# Altium project CarrierMotherboard.PrjPcb (part 3 of 3)

## Sheet PCIE.SchDoc
size A3; SheetNumber: 9; SheetTotal: 9
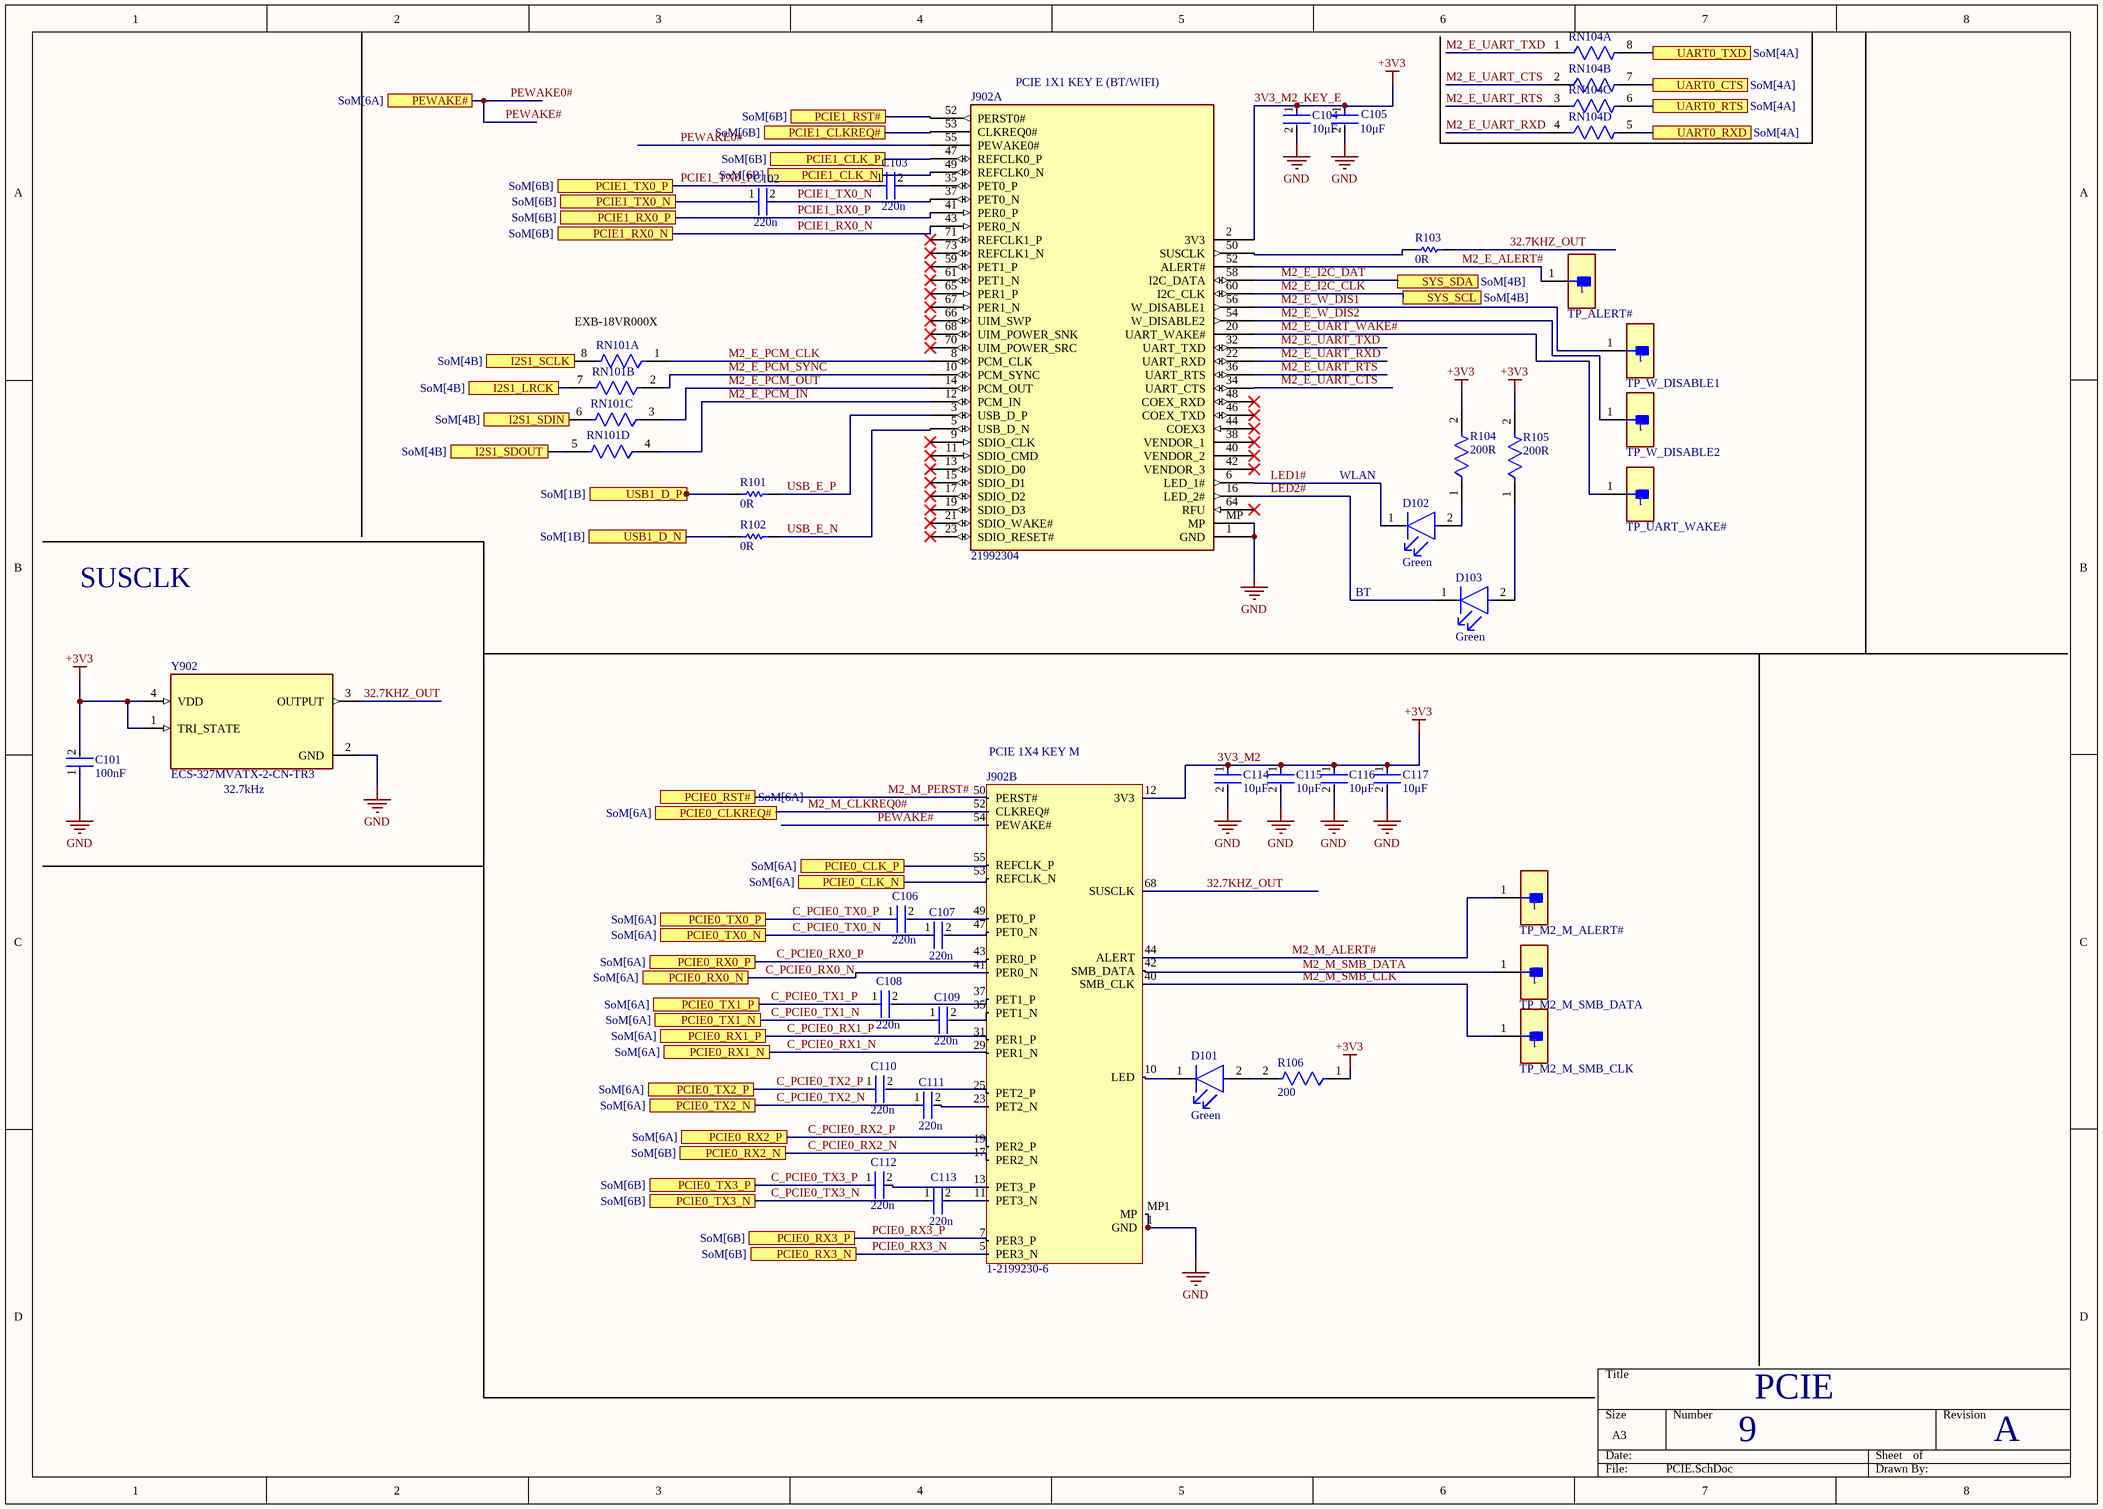
[diagram p9: PCIE.SchDoc]

### Parts
C101  100nF  [FP-GRM155-0_05-IPC_B]
C102  220n  [FP-C1005-050-0_05-IPC_B]
C103  220n  [FP-C1005-050-0_05-IPC_B]
C104  10μF  [FP-GRM31C-0_2-e0_3_0_8-MFG]
C105  10μF  [FP-GRM31C-0_2-e0_3_0_8-MFG]
C106  220n  [FP-C1005-050-0_05-IPC_B]
C107  220n  [FP-C1005-050-0_05-IPC_B]
C108  220n  [FP-C1005-050-0_05-IPC_B]
C109  220n  [FP-C1005-050-0_05-IPC_B]
C110  220n  [FP-C1005-050-0_05-IPC_B]
C111  220n  [FP-C1005-050-0_05-IPC_B]
C112  220n  [FP-C1005-050-0_05-IPC_B]
C113  220n  [FP-C1005-050-0_05-IPC_B]
C114  10μF  [FP-GRM31C-0_2-e0_3_0_8-MFG]
C115  10μF  [FP-GRM31C-0_2-e0_3_0_8-MFG]
C116  10μF  [FP-GRM31C-0_2-e0_3_0_8-MFG]
C117  10μF  [FP-GRM31C-0_2-e0_3_0_8-MFG]
D101  Green  [FP-LTST-C190GKT-MFG]
D102  Green  [FP-LTST-C190GKT-MFG]
D103  Green  [FP-LTST-C190GKT-MFG]
J902  1-2199230-6  [FP-1-2199230-6-MFG]  (part B of 2)
J902A  21992304  [TE_21992304]
R101  0R  [RESC1005X40X25LL05T05]
R102  0R  [RESC1005X40X25LL05T05]
R103  0R  [RESC1005X40X25LL05T05]
R104  200R  [FP-CR0402-IPC_C]
R105  200R  [FP-CR0402-IPC_C]
R106  200  [FP-CR0402-IPC_C]
RN101  (no value)  [FP-EXB-18V-MFG]  (parts A,B,C,D of 4)
RN104  EXB-18VR000X  [FP-EXB-18V-MFG]  (value not drawn)  (parts A,B,C,D of 4)
TP1  TP_ALERT#  [FP-S2751-46R-MFG]
TP2  TP_W_DISABLE1  [FP-S2751-46R-MFG]
TP3  TP_W_DISABLE2  [FP-S2751-46R-MFG]
TP4  TP_UART_WAKE#  [FP-S2751-46R-MFG]
TP5  TP_M2_M_ALERT#  [FP-S2751-46R-MFG]
TP6  TP_M2_M_SMB_DATA  [FP-S2751-46R-MFG]
TP7  TP_M2_M_SMB_CLK  [FP-S2751-46R-MFG]
Y902  ECS-327MVATX-2-CN-TR3  [OSC_ECS-2520S25-250-FN-TR]

### Ports
I2S1_LRCK (see SoM[4B]), I2S1_SCLK (see SoM[4B]), I2S1_SDIN (see SoM[4B]), I2S1_SDOUT (see SoM[4B]), PCIE0_CLK_N (see SoM[6A]), PCIE0_CLK_P (see SoM[6A]), PCIE0_CLKREQ# (see SoM[6A]), PCIE0_RST# (see SoM[6A]), PCIE0_RX0_N (see SoM[6A]), PCIE0_RX0_P (see SoM[6A]), PCIE0_RX1_N (see SoM[6A]), PCIE0_RX1_P (see SoM[6A]), PCIE0_RX2_N (see SoM[6B]), PCIE0_RX2_P (see SoM[6A]), PCIE0_RX3_N (see SoM[6B]), PCIE0_RX3_P (see SoM[6B]), PCIE0_TX0_N (see SoM[6A]), PCIE0_TX0_P (see SoM[6A]), PCIE0_TX1_N (see SoM[6A]), PCIE0_TX1_P (see SoM[6A]), PCIE0_TX2_N (see SoM[6A]), PCIE0_TX2_P (see SoM[6A]), PCIE0_TX3_N (see SoM[6B]), PCIE0_TX3_P (see SoM[6B]), PCIE1_CLK_N (see SoM[6B]), PCIE1_CLK_P (see SoM[6B]), PCIE1_CLKREQ# (see SoM[6B]), PCIE1_RST# (see SoM[6B]), PCIE1_RX0_N (see SoM[6B]), PCIE1_RX0_P (see SoM[6B]), PCIE1_TX0_N (see SoM[6B]), PCIE1_TX0_P (see SoM[6B]), PEWAKE# (see SoM[6A]), SYS_SCL (see SoM[4B]), SYS_SDA (see SoM[4B]), UART0_CTS (see SoM[4A]), UART0_RTS (see SoM[4A]), UART0_RXD (see SoM[4A]), UART0_TXD (see SoM[4A]), USB1_D_N (see SoM[1B]), USB1_D_P (see SoM[1B])

### Nets
3V3_M2: C101.2 C104.1 C105.1 C114.1 C115.1 C116.1 C117.1 J902.12(3V3) J902A.2(3V3) R104.2 R105.2 R106.1 Y902.1(TRI_STATE) Y902.4(VDD)  [also labelled +3V3, 3V3_M2_KEY_E]
GND: C101.1 C104.2 C105.2 C114.2 C115.2 C116.2 C117.2 J902.1(GND) J902.MP1(MP) J902A.1(GND) J902A.MP Y902.2(GND)  [project net 3V3_VDRV]
32.7KHZ_OUT: J902.68(SUSCLK) R103.2 Y902.3(OUTPUT)
C_PCIE0_RX0_N: J902.41(PER0_N) ; port PCIE0_RX0_N
C_PCIE0_RX0_P: J902.43(PER0_P) ; port PCIE0_RX0_P
C_PCIE0_RX1_N: J902.29(PER1_N) ; port PCIE0_RX1_N
C_PCIE0_RX1_P: J902.31(PER1_P) ; port PCIE0_RX1_P
C_PCIE0_RX2_N: J902.17(PER2_N) ; port PCIE0_RX2_N
C_PCIE0_RX2_P: J902.19(PER2_P) ; port PCIE0_RX2_P
C_PCIE0_TX0_N: C107.1 ; port PCIE0_TX0_N
C_PCIE0_TX0_P: C106.1 ; port PCIE0_TX0_P
C_PCIE0_TX1_N: C109.1 ; port PCIE0_TX1_N
C_PCIE0_TX1_P: C108.1 ; port PCIE0_TX1_P
C_PCIE0_TX2_N: C111.1 ; port PCIE0_TX2_N
C_PCIE0_TX2_P: C110.1 ; port PCIE0_TX2_P
C_PCIE0_TX3_N: C113.1 ; port PCIE0_TX3_N
C_PCIE0_TX3_P: C112.1 ; port PCIE0_TX3_P
LED1#: D102.1(C) J902A.6(LED_1#)
LED2#: D103.1(C) J902A.16(LED_2#)
M2_E_ALERT#: J902A.52(ALERT#) TP1.1
M2_E_I2C_CLK: J902A.60(I2C_CLK) ; port SYS_SCL
M2_E_I2C_DAT: J902A.58(I2C_DATA) ; port SYS_SDA
M2_E_PCM_CLK: J902A.8(PCM_CLK) RN101.1
M2_E_PCM_IN: J902A.12(PCM_IN) RN101.4
M2_E_PCM_OUT: J902A.14(PCM_OUT) RN101.3
M2_E_PCM_SYNC: J902A.10(PCM_SYNC) RN101.2
M2_E_UART_CTS: J902A.34(UART_CTS) RN104.2
M2_E_UART_RTS: J902A.36(UART_RTS) RN104.3
M2_E_UART_RXD: J902A.22(UART_RXD) RN104.4
M2_E_UART_TXD: J902A.32(UART_TXD) RN104.1
M2_E_UART_WAKE#: J902A.20(UART_WAKE#) TP4.1
M2_E_W_DIS1: J902A.56(W_DISABLE1) TP2.1
M2_E_W_DIS2: J902A.54(W_DISABLE2) TP3.1
M2_M_ALERT#: J902.44(ALERT) TP5.1
M2_M_CLKREQ0#: J902.52(CLKREQ#) ; port PCIE0_CLKREQ#
M2_M_PERST#: J902.50(PERST#) ; port PCIE0_RST#
M2_M_SMB_CLK: J902.40(SMB_CLK) TP7.1
M2_M_SMB_DATA: J902.42(SMB_DATA) TP6.1
PCIE0_RX3_N: J902.5(PER3_N) ; port PCIE0_RX3_N
PCIE0_RX3_P: J902.7(PER3_P) ; port PCIE0_RX3_P
PCIE1_RX0_N: J902A.43(PER0_N) ; port PCIE1_RX0_N
PCIE1_RX0_P: J902A.41(PER0_P) ; port PCIE1_RX0_P
PCIE1_TX0_N: C102.2 J902A.37(PET0_N)
PCIE1_TX0_P: C103.1 ; port PCIE1_TX0_P
PEWAKE#: J902.54(PEWAKE#) J902A.55(PEWAKE0#) ; port PEWAKE#  [also labelled PEWAKE0#]
USB_E_N: J902A.5(USB_D_N) R102.2
USB_E_P: J902A.3(USB_D_P) R101.2
NetC102_1: C102.1 ; port PCIE1_TX0_N
NetC103_2: C103.2 J902A.35(PET0_P)
NetC106_2: C106.2 J902.49(PET0_P)
NetC107_2: C107.2 J902.47(PET0_N)
NetC108_2: C108.2 J902.37(PET1_P)
NetC109_2: C109.2 J902.35(PET1_N)
NetC110_2: C110.2 J902.25(PET2_P)
NetC111_2: C111.2 J902.23(PET2_N)
NetC112_2: C112.2 J902.13(PET3_P)
NetC113_2: C113.2 J902.11(PET3_N)
NetD101_1: D101.1(C) J902.10(LED)
NetD101_2: D101.2(A) R106.2
NetD102_2: D102.2(A) R104.1
NetD103_2: D103.2(A) R105.1
NetJ15A_99: RN104.8 ; port UART0_TXD
NetJ15A_101: RN104.5 ; port UART0_RXD
NetJ15A_103: RN104.6 ; port UART0_RTS
NetJ15A_105: RN104.7 ; port UART0_CTS
NetJ15A_115: R102.1 ; port USB1_D_N
NetJ15A_117: R101.1 ; port USB1_D_P
NetJ15A_160: J902.53(REFCLK_N) ; port PCIE0_CLK_N
NetJ15A_162: J902.55(REFCLK_P) ; port PCIE0_CLK_P
NetJ15A_173: J902A.49(REFCLK0_N) ; port PCIE1_CLK_N
NetJ15A_175: J902A.47(REFCLK0_P) ; port PCIE1_CLK_P
NetJ15A_182: J902A.53(CLKREQ0#) ; port PCIE1_CLKREQ#
NetJ15A_183: J902A.52(PERST0#) ; port PCIE1_RST#
NetJ15A_220: RN101.5 ; port I2S1_SDOUT
NetJ15A_222: RN101.6 ; port I2S1_SDIN
NetJ15A_224: RN101.7 ; port I2S1_LRCK
NetJ15A_226: RN101.8 ; port I2S1_SCLK
NetJ902A_50: J902A.50(SUSCLK) R103.1

Not connected (* = marked no-connect by the designer): J902A 9(SDIO_CLK)* 11(SDIO_CMD)* 13(SDIO_D0)* 15(SDIO_D1)* 17(SDIO_D2)* 19(SDIO_D3)* 21(SDIO_WAKE#)* 23(SDIO_RESET#)* 38(VENDOR_1)* 40(VENDOR_2)* 42(VENDOR_3)* 44(COEX3)* 46(COEX_TXD)* 48(COEX_RXD)* 59(PET1_P)* 61(PET1_N)* 64(RFU)* 65(PER1_P)* 66(UIM_SWP)* 67(PER1_N)* 68(UIM_POWER_SNK)* 70(UIM_POWER_SRC)* 71(REFCLK1_P)* 73(REFCLK1_N)*

### Notes on the sheet
- (near J902A) PCIE 1X1 KEY E (BT/WIFI)
- (near RN101) EXB-18VR000X
- WLAN
- SUSCLK
- BT
- (near J902) PCIE 1X4 KEY M
- (near Y902) 32.7kHz
- 9
- PCIE
- A

### Library data of the parts
C101 = CMP-2008-04639-2: Chip Multilayer Ceramic Capacitors for General Purpose, 0402, 0.10uF, X7R, 15%, 10%, 50V; Dissipation Factor: 0.025%; Weight: 0.000212oz; Thickness: 0.022inch; Voltage Rating (DC): 50V; Dielectric Material: Ceramic; Termination: SMD/SMT; Case/Package: 0402; Case Code (Imperial): 0402; Mount: Surface Mount; REACH SVHC: No SVHC; Resistor Type: Ceramic; Dielectric: X7R; Max Operating Temperature: 125°C; Voltage: 50V; Lead Free: Lead Free; Package Quantity: 10000; Packaging: Tape and Reel; Capacitance: 100nF; Length: 1mm; Material: Ceramic; Height: 0.5mm; Depth: 0.5mm; Width: 0.5mm; Min Operating Temperature: -55°C; Tolerance: 10%; Case Code (Metric): 1005; Voltage Rating: 50V
C102 C103 C106-C113 = CMP-08246-005722-1: Multilayer Ceramic Capacitors 220nF ±10% 16V X7R SMD 0402; Weight: 2.3E-05oz; Radiation Hardening: No; Packaging: Tape and Reel; Construction: Flat; Height: 0.5mm; REACH SVHC: No SVHC; Case Code (Metric): 1005; Case/Package: 0402; Mount: Surface Mount; Thickness: 0.022inch; Width: 0.02inch; Tolerance: 10%; Capacitance: 220nF; RoHS Compliant: Yes; Lead Free: Lead Free; Series: C; Case Code (Imperial): 0402; Resistor Type: Ceramic; Voltage: 16V; Voltage Rating: 16V; Dielectric Material: Ceramic; Dissipation Factor: 10%; Length: 1mm; Termination: SMD/SMT; Package Quantity: 1; Dielectric: X7R; Min Operating Temperature: -55°C; Depth: 0.5mm; Max Operating Temperature: 125°C; Voltage Rating (DC): 16V
C104 C105 C114-C117 = CMP-06035-005515-1: Chip Multilayer Ceramic Capacitors for General Purpose, 1206, 10uF, X7R, 15%, 10%, 25V; Dielectric: X7R; Max Operating Temperature: 125°C; Capacitance: 10uF; Voltage Rating (DC): 25V; Case/Package: 1206; Thickness: 0.071inch; Tolerance: 10%; Voltage Rating: 25V; Mount: Surface Mount; Width: 0.063inch; Length: 0.126inch; Min Operating Temperature: -55°C; Packaging: Tape and Reel; Lead Free: Lead Free; Voltage: 25V
D101-D103 = CMP-22017-000005-2: LED GREEN CLEAR CHIP SMD; Dominant Wavelength: 569nm; Reverse Voltage: 5V; Lens Color: Colorless; Viewing Angle: 130°; Voltage: 2V; Forward Current: 30mA; Power Dissipation: 100mW; Luminous Intensity: 6mcd; Number of LEDs: 1; Forward Voltage: 2.1V; Wavelength: 565nm; Test Current: 10mA; Min Operating Temperature: -55°C; Lens Style: Clear; Mount: Surface Mount; Width: 0.8mm; Packaging: Tape and Reel; Lens Transparency: Clear; Case Code (Metric): 1608; Depth: 0.8mm; Case Code (Imperial): 0603; Case/Package: 0603; Number of Pins: 2; Max Operating Temperature: 85°C; Lead Free: Lead Free; Number of Elements: 1; Length: 1.6mm; Height: 0.8mm; Package Quantity: 1; Power Rating: 100mW; Radiation Hardening: No; Illumination Color: Green; Color: Green
J902 = CMP-002-00073-2: Card Edge Connector, Dual Side, 67 Contacts, Surface Mount, Right Angle; Gender: Receptacle; Voltage Rating: 50V; Min Operating Temperature: -40°C; Mounting Technology: Surface Mount; Max Operating Temperature: 80°C; Pins: 67; PartId: 2
J902A = CMP-002-00081-2: Connector, Backplane, Housing, Receptacle, 67 Position, 2row; MP: 2199230-4; MF: TE Connectivity; Source: 21992304.SchLib; Check_prices: https://www.snapeda.com/parts/2199230-4/TE+Connectivity+AMP+Connectors/view-part/?ref=eda; Price: None; Case/Package: None; Availability: In Stock; SnapEDA_Link: https://www.snapeda.com/parts/2199230-4/TE+Connectivity+AMP+Connectors/view-part/?ref=snap; Value: *; Component Type: Standard; Pins: 69; Design Item ID: 21992304; Purchase-URL: https://pricing.snapeda.com/search/part/2199230-4/?ref=eda; EU_RoHS_Compliance: Compliant
R101-R103 = CMP-2000-07451-1: Chip Resistor, 0 Ohm, 0.1 W, -55 to 155 degC, 0402 (1005 Metric), RoHS, Tape and Reel; Manufacturer: Panasonic; Voltage Rating (DC): 50V; Temperature Coefficient: 600ppm/��C; Max Power Dissipation: 100mW; Resistance: 0mOhm; Tolerance: 5%; Number of Terminations: 2; Mount: SurfaceMount; Height: 0.35mm; Packaging: TapeandReel; Contact Plating: Tin; Manufacturer URL: http://www.panasonic.com/; Composition: ThickFilm; Max Operating Temperature: 155degC; REACH SVHC: NoSVHC; Case/Package: 0402; Package Reference: 402; Depth: 0.5mm; Package Description: 2-Pin Surface Mount Device, Body 1 x 0.5 mm; Datasheet URL: https://industrial.panasonic.com/cdbs/www-data/pdf/RDA0000/AOA0000C301.pdf; RoHSCompliant: True; Case Code (Imperial): 0402; Military Standard: Not; Min Operating Temperature: -55degC; Power Rating: 100mW; Datasheet Version: 03/2015; Length: 1mm; Case Code (Metric): 1005; Termination: SMD/SMT; Mounting Technology: SurfaceMount; Voltage Rating: 50V; Width: 0.02inch; Package Quantity: 1; Lead Free: LeadFree; Radiation Hardening: No
R104 R105 = CMP-2002-04898-2: Thick Film Chip Resistors 0402 200Ω 0.0625W 1% 100ppm/°C; Power Rating: 62.5mW; Voltage Rating: 50V; Max Power Dissipation: 63mW; Case/Package: 0402; Resistance: 200R; Packaging: Tape and Reel; Mount: Surface Mount; Contact Plating: Tin; Termination: SMD/SMT; Length: 1mm; Min Operating Temperature: -55°C; Case Code (Imperial): 0402; Thickness: 356um; Width: 0.5mm; Temperature Coefficient: 100ppm/°C; Composition: Thick Film; Case Code (Metric): 1005; Package Quantity: 10000; Military Standard: Not; Max Operating Temperature: 125°C; Radiation Hardening: No; Number of Terminations: 2; Tolerance: 1%; Height: 0.016inch; Depth: 0.5mm
R106 = CMP-2002-04898-2: Thick Film Chip Resistors 0402 200Ω 0.0625W 1% 100ppm/°C; Power Rating: 62.5mW; Resistance: 200R; Voltage Rating: 50V; Max Power Dissipation: 63mW; Case/Package: 0402; Packaging: Tape and Reel; Mount: Surface Mount; Contact Plating: Tin; Termination: SMD/SMT; Length: 1mm; Min Operating Temperature: -55°C; Case Code (Imperial): 0402; Thickness: 356um; Width: 0.5mm; Temperature Coefficient: 100ppm/°C; Composition: Thick Film; Case Code (Metric): 1005; Package Quantity: 10000; Military Standard: Not; Max Operating Temperature: 125°C; Radiation Hardening: No; Number of Terminations: 2; Tolerance: 1%; Height: 0.016inch; Depth: 0.5mm
RN101 = CMP-05421-000001-1: RES ARRAY 4 RES ZERO OHM 0502; Manufacturer: Panasonic Electronic Components; Manufacturer Part Number: EXB-18VR000X; Temperature Coefficient: -200/+600ppm/°C; Number Of Resistors: 4; Value: 0Ω; Voltage Rating: 12.5V; Power Rating: 0.1W; Power Per Resistor: 0.031W; Tolerance: 5%; Composition: Thick Film; Temperature: -55°C to +125°C; Device Class L1: Passive Components; RoHS: TRUE; Height: 0.45mm; Octopart: https://octopart.com/exb-18vr000x-panasonic-39836506; Termination: Flat; Temperature Range Low: -55°C; Lead Free: Yes; Automotive: No; Temperature Range High: +125°C; Series: EXB; Category: Res; ComponentLink2URL: https://industrial.panasonic.com/cdbs/www-data/pdf/AOC0000/AOC0000C14.pdf; Device Class L2: Resistors; Package: EXB-18V; ComponentLink2Description: Datasheet; Resistance: 0Ω; Digikey Description: RES ARRAY 4 RES ZERO OHM 0502; Footprint Url: https://industrial.panasonic.com/cdbs/www-data/pdf/AOC0000/AOC0000COL4.pdf; Device Class L3: Resistor Arrays; Mouser Description: Resistor Networks & Arrays Resistor Array Chip 0502 4 Elements
RN104 = CMP-05421-000001-1: RES ARRAY 4 RES ZERO OHM 0502; Manufacturer: Panasonic Electronic Components; Temperature Coefficient: -200/+600ppm/°C; Number Of Resistors: 4; Value: 0Ω; Voltage Rating: 12.5V; Power Rating: 0.1W; Power Per Resistor: 0.031W; Tolerance: 5%; Composition: Thick Film; Temperature: -55°C to +125°C; Device Class L1: Passive Components; RoHS: TRUE; Height: 0.45mm; Octopart: https://octopart.com/exb-18vr000x-panasonic-39836506; Termination: Flat; Temperature Range Low: -55°C; Lead Free: Yes; Automotive: No; Temperature Range High: +125°C; Series: EXB; Category: Res; ComponentLink2URL: https://industrial.panasonic.com/cdbs/www-data/pdf/AOC0000/AOC0000C14.pdf; Device Class L2: Resistors; Package: EXB-18V; ComponentLink2Description: Datasheet; Manufacturer Part Number: EXB-18VR000X; Resistance: 0Ω; Digikey Description: RES ARRAY 4 RES ZERO OHM 0502; Footprint Url: https://industrial.panasonic.com/cdbs/www-data/pdf/AOC0000/AOC0000COL4.pdf; Device Class L3: Resistor Arrays; Mouser Description: Resistor Networks & Arrays Resistor Array Chip 0502 4 Elements
TP1-TP7 = CMP-15817-000010-1: PC TEST POINT NATURAL; Plating: Tin; Body Material: Brass; Color: Natural; Material: Copper Alloy; Mount: Surface Mount; Packaging: Cut Tape
Y902 = CMP-00023-00003-1: Oscillator, 32.768kHz, CMOS, SMD, 2.5mm x 2mm, 3.6V, 25ppm, MultiVolt ECS-327MVATX Series; Min Operating Temperature: -40°C; Mounting Technology: Surface Mount; Frequency: 32.768kHz; Max Operating Temperature: 85°C

## Nets that join several sheets
1V8_LDO: SoM (R202.2 R205.2), Peripherals (8 pins)
3V3_M2: SoM (R207.2), eDP (5 pins), Battery (8 pins), DCDC (9 pins), Peripherals (R703.1 U703.4), Audio (R908.2 R909.2 R910.1), PCIE (14 pins)
3V3_VDRV: SoM (C1.2 C2.2 J15A.1), eDP (46 pins), Power_Delivery (26 pins), Battery (38 pins), DCDC (35 pins), Peripherals (19 pins), Audio (30 pins), PCIE (12 pins)
+5: eDP (R302.1 R311.1), Peripherals (C708.1 U702.1 U702.3)
AVDD: eDP (8 pins), Peripherals (6 pins), Audio (10 pins)
SYS_IN: SoM (R201.1), Battery (TP504.1 TP505.1 U502.25), DCDC (11 pins)
C_PCIE0_RX0_N: SoM (J15A.131), PCIE (J902.41)
C_PCIE0_RX0_P: SoM (J15A.133), PCIE (J902.43)
C_PCIE0_RX1_N: SoM (J15A.137), PCIE (J902.29)
C_PCIE0_RX1_P: SoM (J15A.139), PCIE (J902.31)
C_PCIE0_RX2_N: SoM (J15A.149), PCIE (J902.17)
C_PCIE0_RX2_P: SoM (J15A.151), PCIE (J902.19)
C_PCIE0_TX0_N: SoM (J15A.134), PCIE (C107.1)
C_PCIE0_TX0_P: SoM (J15A.136), PCIE (C106.1)
C_PCIE0_TX1_N: SoM (J15A.140), PCIE (C109.1)
C_PCIE0_TX1_P: SoM (J15A.142), PCIE (C108.1)
C_PCIE0_TX2_N: SoM (J15A.148), PCIE (C111.1)
C_PCIE0_TX2_P: SoM (J15A.150), PCIE (C110.1)
C_PCIE0_TX3_N: SoM (J15A.154), PCIE (C113.1)
C_PCIE0_TX3_P: SoM (J15A.156), PCIE (C112.1)
DEBUG_RXD_1V8: SoM (J15A.238), Peripherals (J701.3)
DEBUG_TXD_1V8: SoM (J15A.236), Peripherals (J701.2)
I2C_SCL_PD: SoM (J15A.232), Power_Delivery (U401.7)
I2C_SDA_PD: SoM (J15A.234), Power_Delivery (U401.8)
INTO_TPS: Power_Delivery (C404.1 D401.1 Q401.3 R403.2), Battery (9 pins)
M2_E_I2C_CLK: SoM (J15A.189), PCIE (J902A.60)
M2_E_I2C_DAT: SoM (J15A.191), PCIE (J902A.58)
M2_M_CLKREQ0#: SoM (J15A.180), PCIE (J902.52)
M2_M_PERST#: SoM (J15A.181), PCIE (J902.50)
NetC102_1: SoM (J15A.172), PCIE (C102.1)
NetD703_1: SoM (J15A.109), Peripherals (D703.1)
NetD704_1: SoM (J15A.111), Peripherals (D704.1)
NetJ15A_63: SoM (J15A.63), eDP (J301.12)
NetJ15A_65: SoM (J15A.65), eDP (J301.13)
NetJ15A_69: SoM (J15A.69), eDP (J301.9)
NetJ15A_71: SoM (J15A.71), eDP (J301.10)
NetJ15A_75: SoM (J15A.75), eDP (J301.6)
NetJ15A_77: SoM (J15A.77), eDP (J301.7)
NetJ15A_81: SoM (J15A.81), eDP (J301.3)
NetJ15A_83: SoM (J15A.83), eDP (J301.4)
NetJ15A_87: SoM (J15A.87), Audio (U901.3)
NetJ15A_98: SoM (J15A.98), eDP (J301.16)
NetJ15A_99: SoM (J15A.99), PCIE (RN104.8)
NetJ15A_100: SoM (J15A.100), eDP (J301.15)
NetJ15A_101: SoM (J15A.101), PCIE (RN104.5)
NetJ15A_103: SoM (J15A.103), PCIE (RN104.6)
NetJ15A_105: SoM (J15A.105), PCIE (RN104.7)
NetJ15A_115: SoM (J15A.115), PCIE (R102.1)
NetJ15A_117: SoM (J15A.117), PCIE (R101.1)
NetJ15A_160: SoM (J15A.160), PCIE (J902.53)
NetJ15A_162: SoM (J15A.162), PCIE (J902.55)
NetJ15A_173: SoM (J15A.173), PCIE (J902A.49)
NetJ15A_175: SoM (J15A.175), PCIE (J902A.47)
NetJ15A_182: SoM (J15A.182), PCIE (J902A.53)
NetJ15A_183: SoM (J15A.183), PCIE (J902A.52)
NetJ15A_185: SoM (J15A.185), Audio (R908.1 U903.17)
NetJ15A_187: SoM (J15A.187), Audio (R909.1 U903.19)
NetJ15A_208: SoM (J15A.208), Peripherals (U701.4)
NetJ15A_220: SoM (J15A.220), PCIE (RN101.5)
NetJ15A_222: SoM (J15A.222), PCIE (RN101.6)
NetJ15A_224: SoM (J15A.224), PCIE (RN101.7)
NetJ15A_226: SoM (J15A.226), PCIE (RN101.8)
NetJ15A_230: SoM (J15A.230), Peripherals (U701.5)
NetJ301_27: SoM (R206.1), eDP (J301.27 R312.1)
NetR208_2: SoM (R208.2), eDP (R302.2 U301.2)
PCIE0_RX3_N: SoM (J15A.155), PCIE (J902.5)
PCIE0_RX3_P: SoM (J15A.157), PCIE (J902.7)
PCIE1_RX0_N: SoM (J15A.167), PCIE (J902A.43)
PCIE1_RX0_P: SoM (J15A.169), PCIE (J902A.41)
PCIE1_TX0_P: SoM (J15A.174), PCIE (C103.1)
PEWAKE#: SoM (J15A.179 R207.1), PCIE (J902.54 J902A.55)
POWER_BUTTON#: SoM (J15A.240), Peripherals (8 pins)
SYS_RESET#: SoM (J201.1 R204.2), eDP (R311.2 U302.2), DCDC (R612.1)
USB_D+: SoM (J15A.123), Audio (R900.1)
USB_D-: SoM (J15A.121), Audio (R902.1)